# EAGLE schematic battery_buzzer (EAGLE 6.5.0)
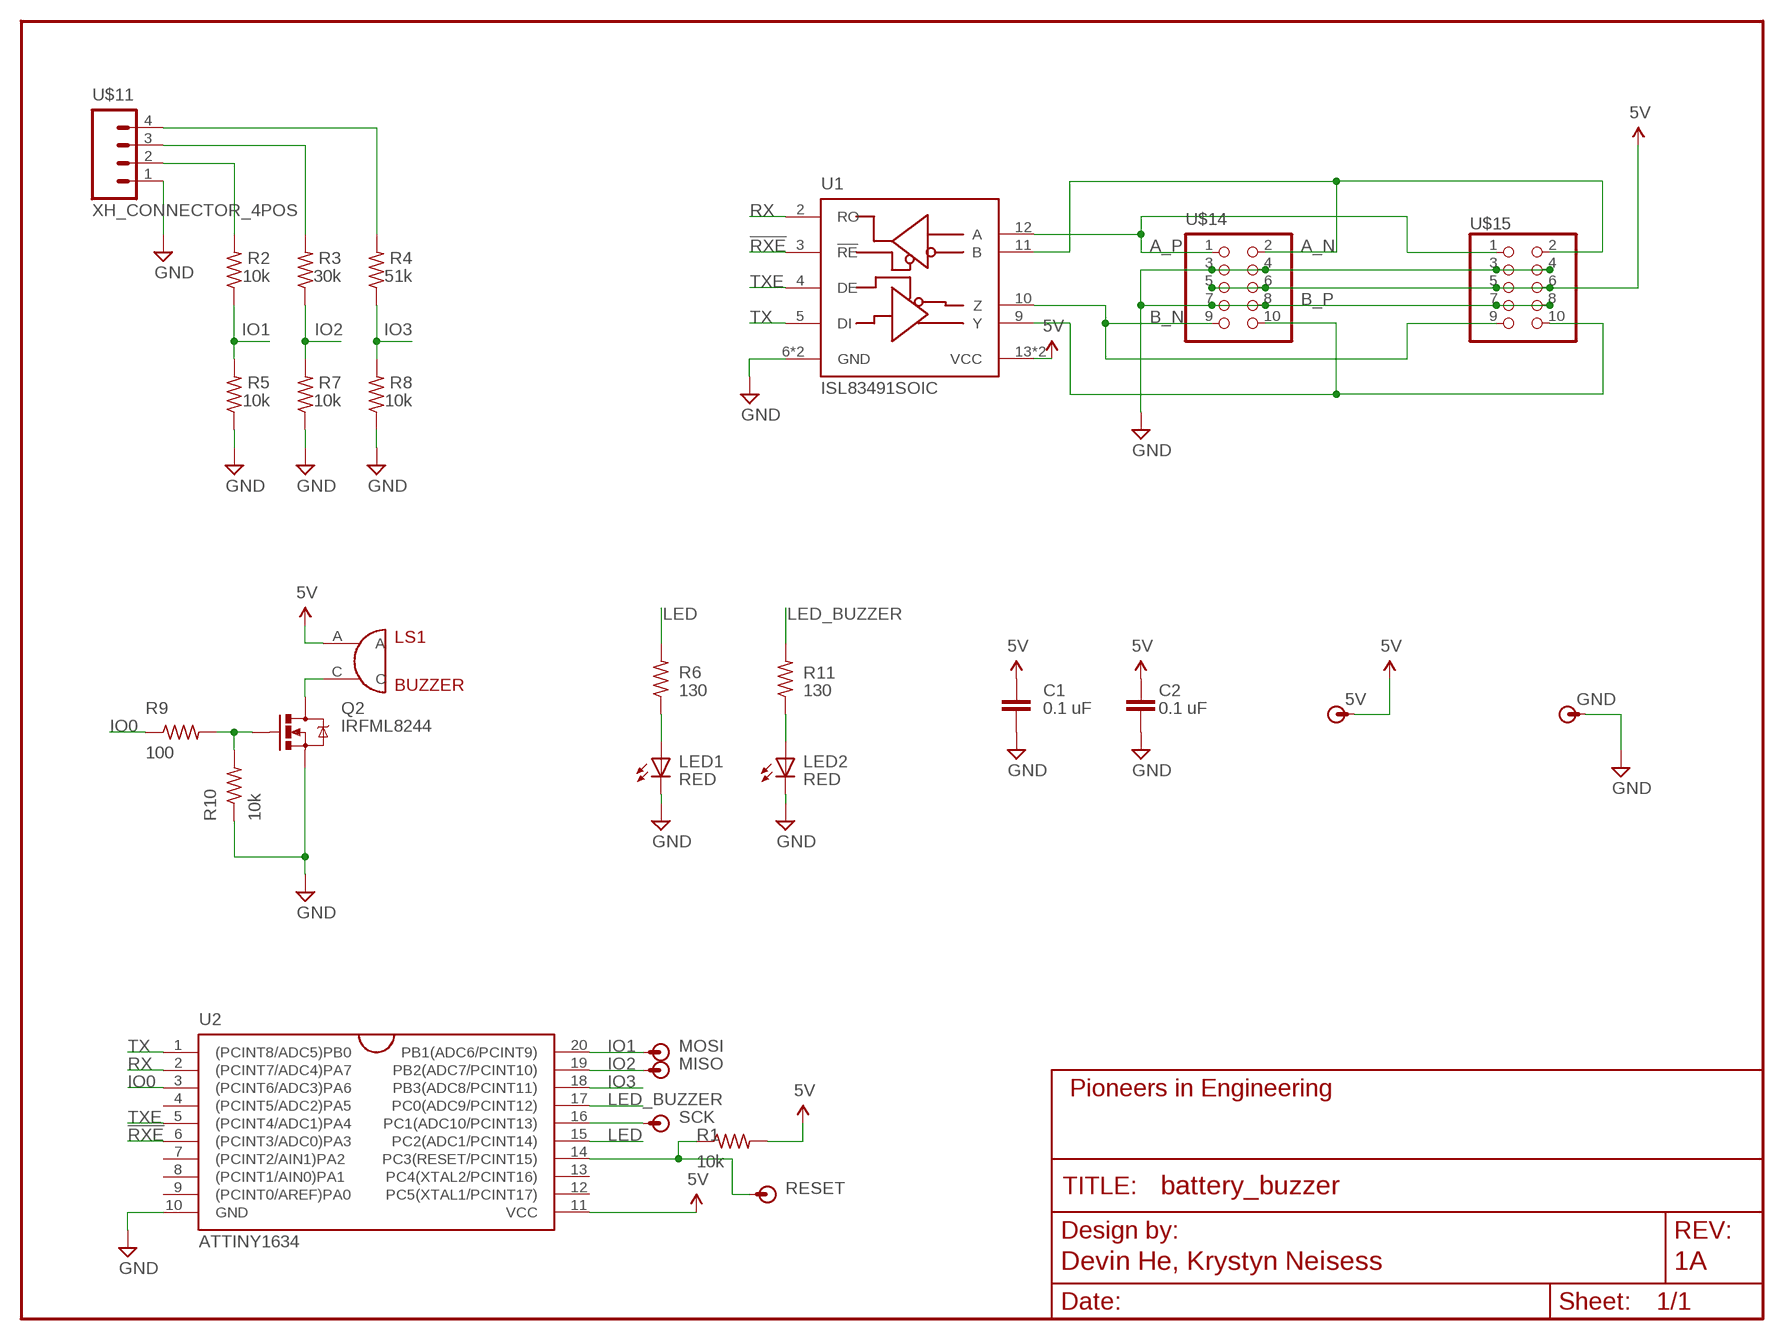
[diagram p0: schematic, sheet 1]
FRAME1 (FRAME-LETTER): AUTHOR: Devin He, Krystyn Neisess; REVISION: 1A

## Parts
5V  POGO_PIN  [POGO_PIN_394]
C1  0.1 uF  CAP0603-CAP  [0603-CAP]
C2  0.1 uF  CAP0603-CAP  [0603-CAP]
GND  POGO_PIN  [POGO_PIN_394]
LED1  RED  LED0805  [LED-0805]
LED2  RED  LED0805  [LED-0805]
LS1  BUZZER  [BUZZER_MAGNETIC_5V_12MM_RADIAL]
MISO  POGO_PIN  [POGO_PIN_394]
MOSI  POGO_PIN  [POGO_PIN_394]
Q2  IRFML8244  MOSFET-NCHANNELSMD  [SOT23-3]
R1  10k  R-US_R0603  [R0603]
R2  10k  R-US_R0603  [R0603]
R3  30k  R-US_R0603  [R0603]
R4  51k  R-US_R0603  [R0603]
R5  10k  R-US_R0603  [R0603]
R6  130  R-US_R0603  [R0603]
R7  10k  R-US_R0603  [R0603]
R8  10k  R-US_R0603  [R0603]
R9  100  R-US_R0603  [R0603]
R10  10k  R-US_R0603  [R0603]
R11  130  R-US_R0603  [R0603]
RESET  POGO_PIN  [POGO_PIN_394]
SCK  POGO_PIN  [POGO_PIN_394]
U1  ISL83491SOIC  [SOIC14]
U2  ATTINY1634  [SOIC20]
U$11  XH_CONNECTOR_4POS  [XH_CONNECTOR_4POS_2.5MM]
U$14  SENSOR_CON_5PINPTH-SHROUDED  [2X5_SHROUDED]
U$15  SENSOR_CON_5PINSMD-EDGE  [2X5-EDGE]

## Nets
5V: 5V.POGO_PIN C1.1 C2.1 LS1.A R1.2 U1.13(VCC) U1.14(VCC) U2.11(VCC) U$14.5 U$14.6 U$15.5 U$15.6
!RXE: U1.3(!RE) U2.6((PCINT3/ADC0)PA3)
A_N: U1.11(B) U$14.2 U$15.2
A_P: U1.12(A) U$14.1 U$15.1
B_N: U1.10(Z) U$14.9 U$15.9
B_P: U1.9(Y) U$14.10 U$15.10
GND: C1.2 C2.2 GND.POGO_PIN LED1.C LED2.C Q2.2(S) R5.1 R7.1 R8.1 R10.1 U1.6(GND) U1.7(GND) U2.10(GND) U$11.1 U$14.3 U$14.4 U$14.7 U$14.8 U$15.3 U$15.4 U$15.7 U$15.8
IO0: R9.1 U2.3((PCINT6/ADC3)PA6)
IO1: MOSI.POGO_PIN R2.1 R5.2 U2.20(PB1(ADC6/PCINT9))
IO2: MISO.POGO_PIN R3.1 R7.2 U2.19(PB2(ADC7/PCINT10))
IO3: R4.1 R8.2 U2.18(PB3(ADC8/PCINT11))
LED: R6.2 U2.15(PC2(ADC1/PCINT14))
LED_BUZZER: R11.2 U2.17(PC0(ADC9/PCINT12))
N$1: R2.2 U$11.2
N$2: R3.2 U$11.3
N$3: LED1.A R6.1
N$4: R4.2 U$11.4
N$5: LS1.C Q2.3(D)
N$6: Q2.1(G) R9.2 R10.2
N$7: LED2.A R11.1
N$8: SCK.POGO_PIN U2.16(PC1(ADC10/PCINT13))
RESET: R1.1 RESET.POGO_PIN U2.14(PC3(RESET/PCINT15))
RX: U1.2(RO) U2.2((PCINT7/ADC4)PA7)
TX: U1.5(DI) U2.1((PCINT8/ADC5)PB0)
TXE: U1.4(DE) U2.5((PCINT4/ADC1)PA4)
Unconnected: U2.4((PCINT5/ADC2)PA5) U2.7((PCINT2/AIN1)PA2) U2.8((PCINT1/AIN0)PA1) U2.9((PCINT0/AREF)PA0) U2.12(PC5(XTAL1/PCINT17)) U2.13(PC4(XTAL2/PCINT16))

## Library data of the parts
5V GND MISO MOSI RESET SCK = pie:POGO_PIN: Pogo Pin Mounting/Probing Pad; PIE-INT-REF-NUM: POGO-PIN
C1 C2 = pie:CAP: Capacitor Standard 0603 ceramic capacitor, and 0.1" leaded capacitor.; PIE-INT-REF-NUM: CAPACITOR-GENERIC
LED1 LED2 = pie:LED: LEDs Standard schematic elements and footprints for 5mm, 3mm, 1206, and 0603 sized LEDs. 5mm - Spark Fun Electronics SKU : COM-00529 (and others); PIE-INT-REF-NUM: LED
LS1 = pie:BUZZER: Buzzer; PIE-INT-REF-NUM: BUZZER; PIE_DIGIKEY-PN: 102-1269-ND
Q2 = pie:MOSFET-NCHANNEL: N-Type MOSFET, SOT23-3 Package; PIE-INT-REF-NUM: NMOS
R1-R11 = pie:R-US_: RESISTOR, American symbol; PIE-INT-REF-NUM: RESISTOR-GENERIC
U1 = pie:ISL83491; PIE-INT-REF-NUM: rs485_491
U2 = pie:ATTINY1634; PIE-INT-REF-NUM: ATtiny1634
U$11 = pie:XH_CONNECTOR_4POS: 4-pin XH connector (through-hole type shrouded header); PIE-INT-REF-NUM: XH-4POS; PIE_DIGIKEY-PN: 455-2249-ND
U$14 U$15 = pie:SENSOR_CON_5PIN